# Altium schematic sheet Processor.SchDoc
size A; SheetNumber: 3; SheetTotal: 11
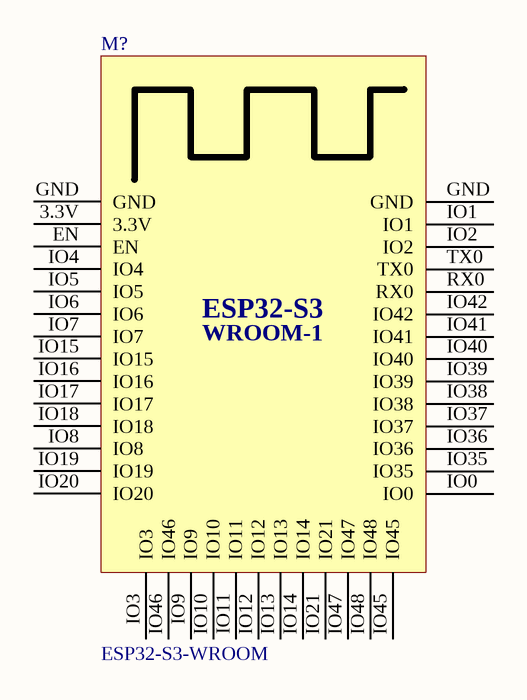
[diagram p0: Processor.SchDoc]

## Parts
M?  ESP32-S3-WROOM  [ESP32-S3-WROOM-1]

## Nets

Not connected (* = marked no-connect by the designer): M? 3.3V EN GND IO0 IO1 IO2 IO3 IO4 IO5 IO6 IO7 IO8 IO9 IO10 IO11 IO12 IO13 IO14 IO15 IO16 IO17 IO18 IO19 IO20 IO21 IO35 IO36 IO37 IO38 IO39 IO40 IO41 IO42 IO45 IO46 IO47 IO48 RX0 TX0

## Notes on the sheet
- (in symbol ESP32-S3-WROOM-1) ESP32-S3; WROOM-1

## Library data of the parts
M? = ESP32-S3-WROOM-1: Datasheet: https://www.espressif.com/sites/default/files/documentation/esp32-s3-wroom-1_wroom-1u_datasheet_en.pdf